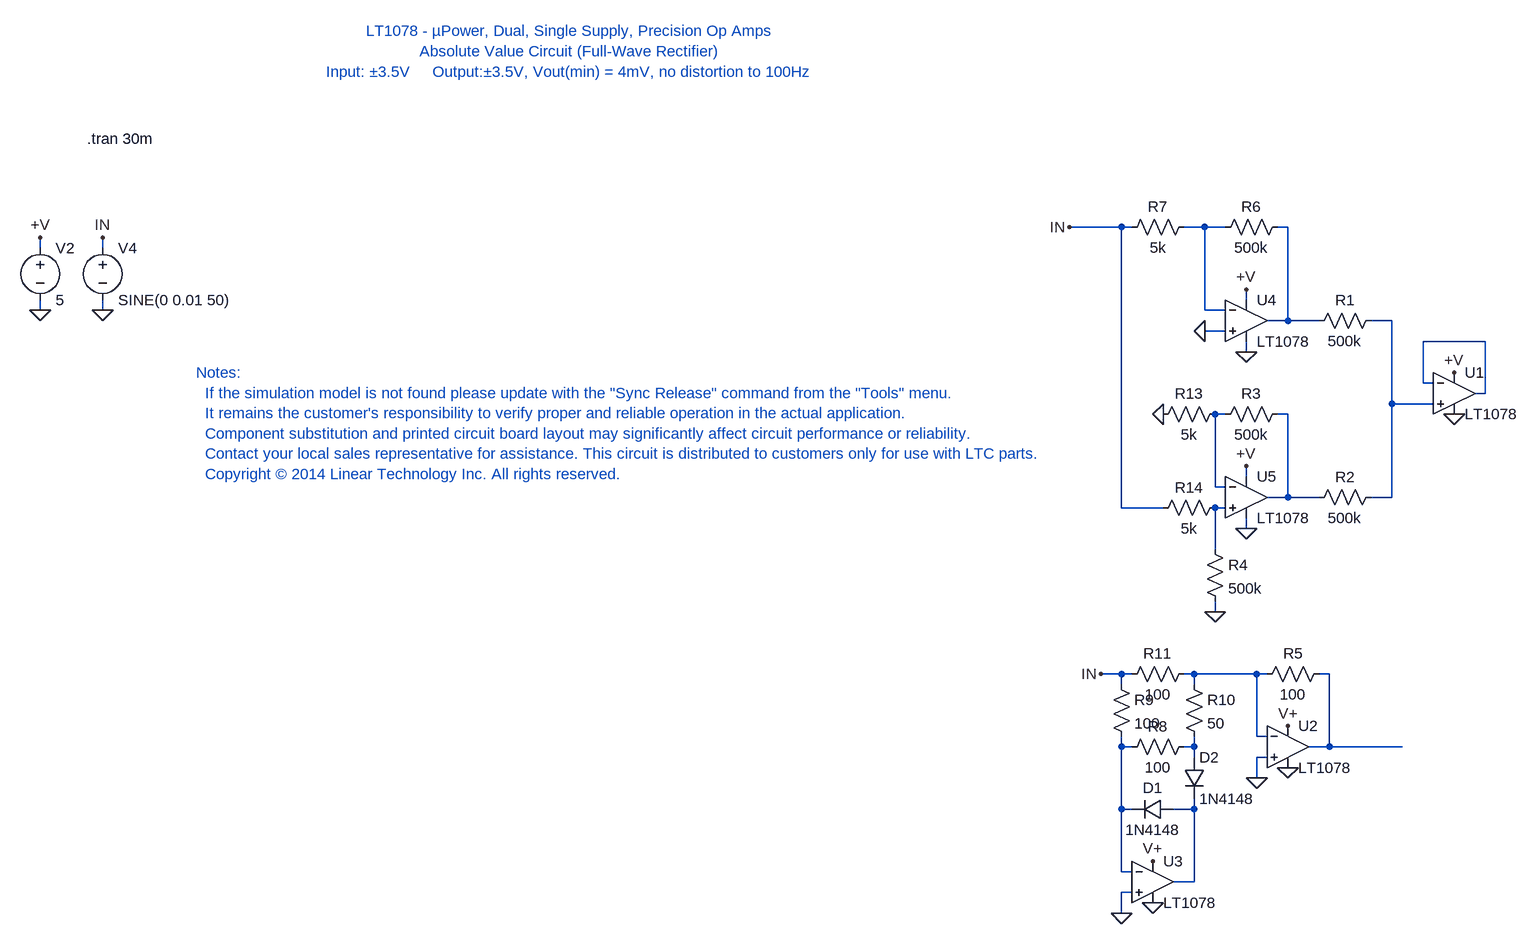
[diagram p0: schematic rect2.asc]
rect2.asc, the LTspice schematic file:
Version 4
SHEET 1 2072 1156
WIRE 1040 80 960 80
WIRE 1056 80 1040 80
WIRE 1168 80 1136 80
WIRE 1200 80 1168 80
WIRE 1296 80 1280 80
WIRE -624 112 -624 96
WIRE -528 112 -528 96
WIRE 1232 192 1232 176
WIRE -624 208 -624 192
WIRE -528 208 -528 192
WIRE 1168 208 1168 80
WIRE 1200 208 1168 208
WIRE 1296 224 1296 80
WIRE 1296 224 1264 224
WIRE 1344 224 1296 224
WIRE 1456 224 1424 224
WIRE 1200 240 1168 240
WIRE 1600 256 1504 256
WIRE 1232 272 1232 256
WIRE 1504 320 1504 256
WIRE 1520 320 1504 320
WIRE 1600 336 1600 256
WIRE 1600 336 1584 336
WIRE 1456 352 1456 224
WIRE 1520 352 1456 352
WIRE 1200 368 1184 368
WIRE 1296 368 1280 368
WIRE 1232 464 1232 448
WIRE 1184 480 1184 368
WIRE 1200 480 1184 480
WIRE 1296 496 1296 368
WIRE 1296 496 1264 496
WIRE 1344 496 1296 496
WIRE 1456 496 1456 352
WIRE 1456 496 1424 496
WIRE 1040 512 1040 80
WIRE 1104 512 1040 512
WIRE 1200 512 1184 512
WIRE 1232 544 1232 528
WIRE 1184 576 1184 512
WIRE 1184 672 1184 656
WIRE 1040 768 1008 768
WIRE 1056 768 1040 768
WIRE 1152 768 1136 768
WIRE 1248 768 1152 768
WIRE 1264 768 1248 768
WIRE 1360 768 1344 768
WIRE 1040 784 1040 768
WIRE 1152 784 1152 768
WIRE 1248 864 1248 768
WIRE 1264 864 1248 864
WIRE 1040 880 1040 864
WIRE 1056 880 1040 880
WIRE 1152 880 1152 864
WIRE 1152 880 1136 880
WIRE 1360 880 1360 768
WIRE 1360 880 1328 880
WIRE 1472 880 1360 880
WIRE 1152 896 1152 880
WIRE 1264 896 1248 896
WIRE 1248 928 1248 896
WIRE 1040 976 1040 880
WIRE 1056 976 1040 976
WIRE 1152 976 1152 960
WIRE 1152 976 1120 976
WIRE 1040 1072 1040 976
WIRE 1056 1072 1040 1072
WIRE 1152 1088 1152 976
WIRE 1152 1088 1120 1088
WIRE 1056 1104 1040 1104
WIRE 1040 1136 1040 1104
FLAG 1232 176 +V
FLAG 1232 272 0
FLAG 1168 240 0
FLAG -624 208 0
FLAG -624 96 +V
FLAG -528 208 0
FLAG -528 96 IN
FLAG 960 80 IN
FLAG 1232 448 +V
FLAG 1232 544 0
FLAG 1184 672 0
FLAG 1104 368 0
FLAG 1552 368 0
FLAG 1552 304 +V
FLAG 1088 1120 0
FLAG 1088 1056 V+
FLAG 1296 912 0
FLAG 1296 848 V+
FLAG 1248 928 0
FLAG 1040 1136 0
FLAG 1008 768 IN
SYMBOL res 1296 64 R90
WINDOW 0 0 56 VBottom 2
WINDOW 3 32 56 VTop 2
SYMATTR InstName R6
SYMATTR Value 500k
SYMBOL res 1152 64 R90
WINDOW 0 0 56 VBottom 2
WINDOW 3 32 56 VTop 2
SYMATTR InstName R7
SYMATTR Value 5k
SYMBOL Opamps\\LT1078 1232 160 R0
SYMATTR InstName U4
SYMBOL voltage -624 96 R0
SYMATTR InstName V2
SYMATTR Value 5
SYMBOL voltage -528 96 R0
WINDOW 123 0 0 Left 0
WINDOW 39 0 0 Left 0
SYMATTR InstName V4
SYMATTR Value SINE(0 0.01 50)
SYMBOL Opamps\\LT1078 1232 432 R0
SYMATTR InstName U5
SYMBOL res 1200 352 R90
WINDOW 0 0 56 VBottom 2
WINDOW 3 32 56 VTop 2
SYMATTR InstName R13
SYMATTR Value 5k
SYMBOL res 1200 496 R90
WINDOW 0 0 56 VBottom 2
WINDOW 3 32 56 VTop 2
SYMATTR InstName R14
SYMATTR Value 5k
SYMBOL res 1296 352 R90
WINDOW 0 0 56 VBottom 2
WINDOW 3 32 56 VTop 2
SYMATTR InstName R3
SYMATTR Value 500k
SYMBOL res 1168 560 R0
SYMATTR InstName R4
SYMATTR Value 500k
SYMBOL res 1440 208 R90
WINDOW 0 0 56 VBottom 2
WINDOW 3 32 56 VTop 2
SYMATTR InstName R1
SYMATTR Value 500k
SYMBOL res 1440 480 R90
WINDOW 0 0 56 VBottom 2
WINDOW 3 32 56 VTop 2
SYMATTR InstName R2
SYMATTR Value 500k
SYMBOL Opamps\\LT1078 1552 272 R0
SYMATTR InstName U1
SYMBOL diode 1120 960 R90
WINDOW 0 -1 32 VBottom 2
WINDOW 3 32 32 VTop 2
SYMATTR InstName D1
SYMATTR Value 1N4148
SYMBOL res 1360 752 R90
WINDOW 0 0 56 VBottom 2
WINDOW 3 32 56 VTop 2
SYMATTR InstName R5
SYMATTR Value 100
SYMBOL res 1152 864 R90
WINDOW 0 0 56 VBottom 2
WINDOW 3 32 56 VTop 2
SYMATTR InstName R8
SYMATTR Value 100
SYMBOL res 1024 768 R0
SYMATTR InstName R9
SYMATTR Value 100
SYMBOL res 1136 768 R0
SYMATTR InstName R10
SYMATTR Value 50
SYMBOL res 1152 752 R90
WINDOW 0 0 56 VBottom 2
WINDOW 3 32 56 VTop 2
SYMATTR InstName R11
SYMATTR Value 100
SYMBOL diode 1136 896 R0
SYMATTR InstName D2
SYMATTR Value 1N4148
SYMBOL Opamps\\LT1078 1296 816 R0
SYMATTR InstName U2
SYMBOL Opamps\\LT1078 1088 1024 R0
SYMATTR InstName U3
TEXT 192 -144 Bottom 2 ;LT1078 - µPower, Dual, Single Supply, Precision Op Amps\nAbsolute Value Circuit (Full-Wave Rectifier)\nInput: ±3.5V     Output:±3.5V, Vout(min) = 4mV, no distortion to 100Hz
TEXT -384 304 Left 2 ;Notes:\n  If the simulation model is not found please update with the "Sync Release" command from the "Tools" menu.\n  It remains the customer's responsibility to verify proper and reliable operation in the actual application.\n  Component substitution and printed circuit board layout may significantly affect circuit performance or reliability.\n  Contact your local sales representative for assistance. This circuit is distributed to customers only for use with LTC parts.\n  Copyright © 2014 Linear Technology Inc. All rights reserved.
TEXT -552 -56 Left 2 !.tran 30m

The netlist it stands for:
* rect2.asc
R6 N002 N001 500k
R7 N001 IN 5k
XU4 0 N001 +V 0 N002 LT1078  ; pins In+ In- V+ V- OUT
V2 +V 0 5
V4 IN 0 SINE(0 0.01 50)
XU5 N007 N005 +V 0 N006 LT1078  ; pins In+ In- V+ V- OUT
R13 N005 0 5k
R14 N007 IN 5k
R3 N006 N005 500k
R4 N007 0 500k
R1 N003 N002 500k
R2 N003 N006 500k
XU1 N003 N004 +V 0 N004 LT1078  ; pins In+ In- V+ V- OUT
D1 N012 N010 1N4148
R5 N009 N008 100
R8 N011 N010 100
R9 IN N010 100
R10 N008 N011 50
R11 N008 IN 100
D2 N011 N012 1N4148
XU2 0 N008 V+ 0 N009 LT1078  ; pins In+ In- V+ V- OUT
XU3 0 N010 V+ 0 N012 LT1078  ; pins In+ In- V+ V- OUT
.model D D
.lib standard.dio
* LT1078 - µPower, Dual, Single Supply, Precision Op Amps
* Absolute Value Circuit (Full-Wave Rectifier)
* Input: ±3.5V     Output:±3.5V, Vout(min) = 4mV, no distortion to 100Hz
* Notes:
*   If the simulation model is not found please update with the "Sync Release" command from the "Tools" menu.
*   It remains the customer's responsibility to verify proper and reliable operation in the actual application.
*   Component substitution and printed circuit board layout may significantly affect circuit performance or reliability.
*   Contact your local sales representative for assistance. This circuit is distributed to customers only for use with LTC parts.
*   Copyright © 2014 Linear Technology Inc. All rights reserved.
.tran 30m
.backanno
.end